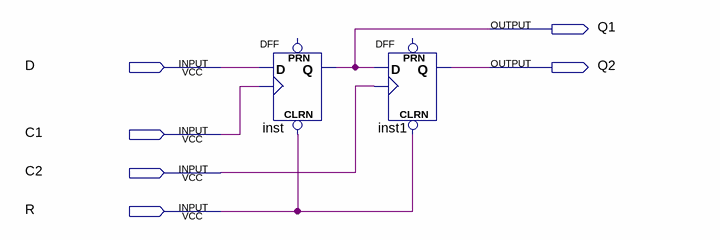
[diagram p0: schematic sheet]
// Quartus schematic D_trig_double_clk.bdf as structural Verilog: 2 symbols, 6 pins
module D_trig_double_clk (
  input  D,
  input  C1,
  input  C2,
  input  R,
  output Q1,
  output Q2
);

  DFF inst (.CLRN(R), .CLK(C1), .D(D), .Q(Q1));  // open: PRN
  DFF inst1 (.CLRN(R), .CLK(C2), .D(Q1), .Q(Q2));  // open: PRN
endmodule
